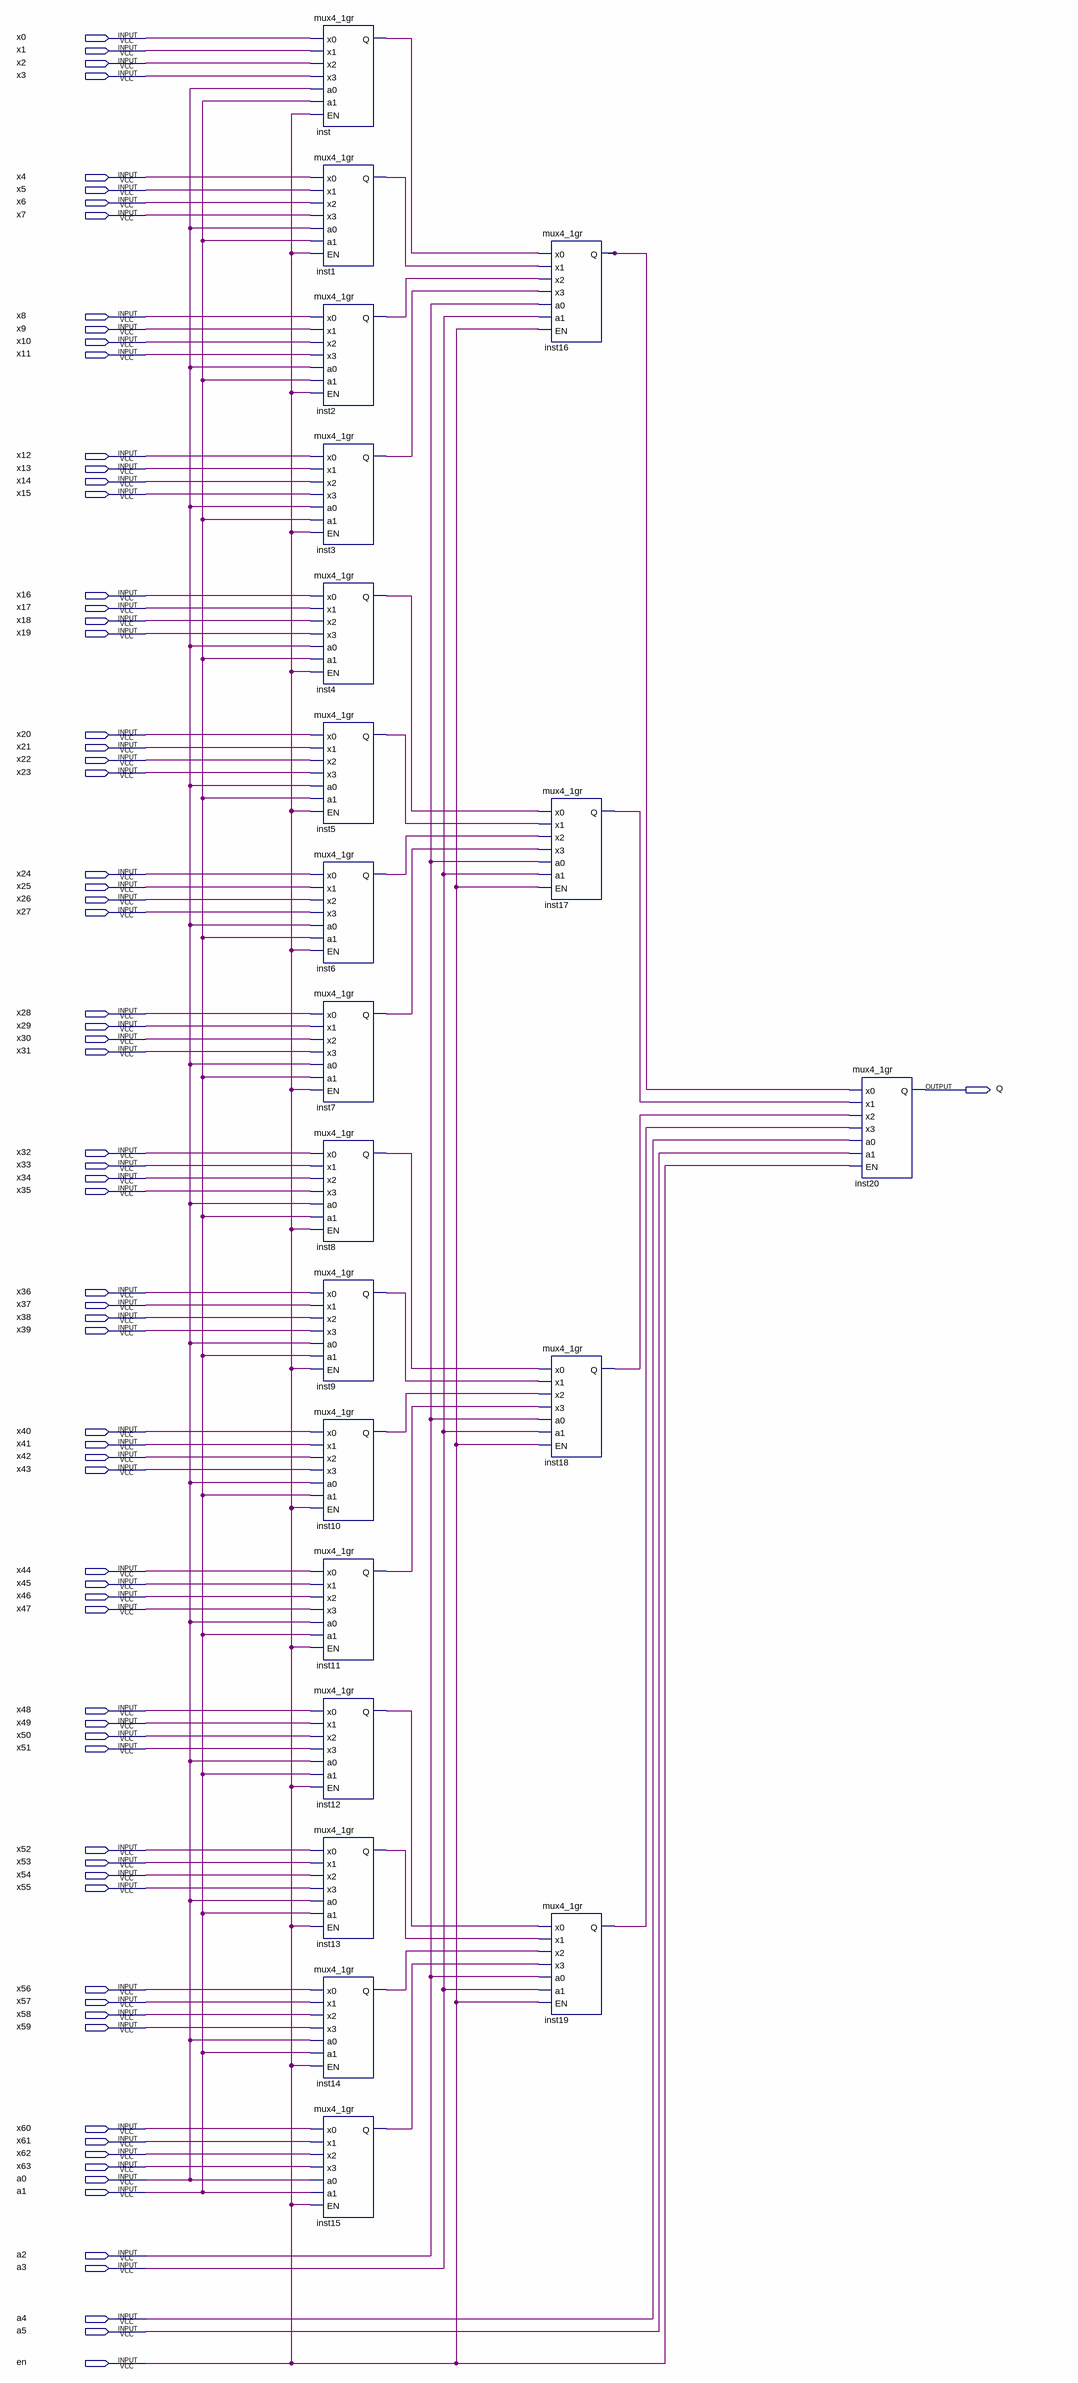
[diagram p0: schematic sheet]
// Quartus schematic mux64_1gr.bdf as structural Verilog: 21 symbols, 72 pins
module mux64_1gr (
  input  x0,
  input  x1,
  input  x2,
  input  x3,
  input  x4,
  input  x5,
  input  x6,
  input  x7,
  input  x8,
  input  x9,
  input  x10,
  input  x11,
  input  x12,
  input  x13,
  input  x14,
  input  x15,
  input  x16,
  input  x17,
  input  x18,
  input  x19,
  input  x20,
  input  x21,
  input  x22,
  input  x23,
  input  x24,
  input  x25,
  input  x26,
  input  x27,
  input  x28,
  input  x29,
  input  x30,
  input  x31,
  input  x32,
  input  x33,
  input  x34,
  input  x35,
  input  x36,
  input  x37,
  input  x38,
  input  x39,
  input  x40,
  input  x41,
  input  x42,
  input  x43,
  input  x44,
  input  x45,
  input  x46,
  input  x47,
  input  x48,
  input  x49,
  input  x50,
  input  x51,
  input  x52,
  input  x53,
  input  x54,
  input  x55,
  input  x56,
  input  x57,
  input  x58,
  input  x59,
  input  x60,
  input  x61,
  input  x62,
  input  x63,
  input  a0,
  input  a1,
  input  a2,
  input  a3,
  input  a4,
  input  a5,
  input  en,
  output Q
);

  wire inst1_q, inst2_q, inst3_q, inst4_q, inst5_q, inst6_q, inst7_q, inst8_q, inst9_q, inst10_q, inst11_q,
       inst12_q, inst13_q, inst14_q, inst15_q, inst16_q, inst17_q, inst18_q, inst19_q, inst_q;

  mux4_1gr inst (.x0(x0), .x1(x1), .x2(x2), .x3(x3), .a0(a0), .a1(a1), .EN(en), .Q(inst_q));
  mux4_1gr inst1 (.x0(x4), .x1(x5), .x2(x6), .x3(x7), .a0(a0), .a1(a1), .EN(en), .Q(inst1_q));
  mux4_1gr inst2 (.x0(x8), .x1(x9), .x2(x10), .x3(x11), .a0(a0), .a1(a1), .EN(en), .Q(inst2_q));
  mux4_1gr inst3 (.x0(x12), .x1(x13), .x2(x14), .x3(x15), .a0(a0), .a1(a1), .EN(en), .Q(inst3_q));
  mux4_1gr inst4 (.x0(x16), .x1(x17), .x2(x18), .x3(x19), .a0(a0), .a1(a1), .EN(en), .Q(inst4_q));
  mux4_1gr inst5 (.x0(x20), .x1(x21), .x2(x22), .x3(x23), .a0(a0), .a1(a1), .EN(en), .Q(inst5_q));
  mux4_1gr inst6 (.x0(x24), .x1(x25), .x2(x26), .x3(x27), .a0(a0), .a1(a1), .EN(en), .Q(inst6_q));
  mux4_1gr inst7 (.x0(x28), .x1(x29), .x2(x30), .x3(x31), .a0(a0), .a1(a1), .EN(en), .Q(inst7_q));
  mux4_1gr inst8 (.x0(x32), .x1(x33), .x2(x34), .x3(x35), .a0(a0), .a1(a1), .EN(en), .Q(inst8_q));
  mux4_1gr inst9 (.x0(x36), .x1(x37), .x2(x38), .x3(x39), .a0(a0), .a1(a1), .EN(en), .Q(inst9_q));
  mux4_1gr inst10 (.x0(x40), .x1(x41), .x2(x42), .x3(x43), .a0(a0), .a1(a1), .EN(en), .Q(inst10_q));
  mux4_1gr inst11 (.x0(x44), .x1(x45), .x2(x46), .x3(x47), .a0(a0), .a1(a1), .EN(en), .Q(inst11_q));
  mux4_1gr inst12 (.x0(x48), .x1(x49), .x2(x50), .x3(x51), .a0(a0), .a1(a1), .EN(en), .Q(inst12_q));
  mux4_1gr inst13 (.x0(x52), .x1(x53), .x2(x54), .x3(x55), .a0(a0), .a1(a1), .EN(en), .Q(inst13_q));
  mux4_1gr inst14 (.x0(x56), .x1(x57), .x2(x58), .x3(x59), .a0(a0), .a1(a1), .EN(en), .Q(inst14_q));
  mux4_1gr inst15 (.x0(x60), .x1(x61), .x2(x62), .x3(x63), .a0(a0), .a1(a1), .EN(en), .Q(inst15_q));
  mux4_1gr inst16 (.x0(inst_q), .x1(inst1_q), .x2(inst2_q), .x3(inst3_q), .a0(a2), .a1(a3), .EN(en), .Q(inst16_q));
  mux4_1gr inst17 (.x0(inst4_q), .x1(inst5_q), .x2(inst6_q), .x3(inst7_q), .a0(a2), .a1(a3), .EN(en), .Q(inst17_q));
  mux4_1gr inst18 (.x0(inst8_q), .x1(inst9_q), .x2(inst10_q), .x3(inst11_q), .a0(a2), .a1(a3), .EN(en), .Q(inst18_q));
  mux4_1gr inst19 (.x0(inst12_q), .x1(inst13_q), .x2(inst14_q), .x3(inst15_q), .a0(a2), .a1(a3), .EN(en), .Q(inst19_q));
  mux4_1gr inst20 (.x0(inst16_q), .x1(inst17_q), .x2(inst18_q), .x3(inst19_q), .a0(a4), .a1(a5), .EN(en), .Q(Q));
endmodule
